# EAGLE design N33_1_0 (EAGLE 8.3.2)
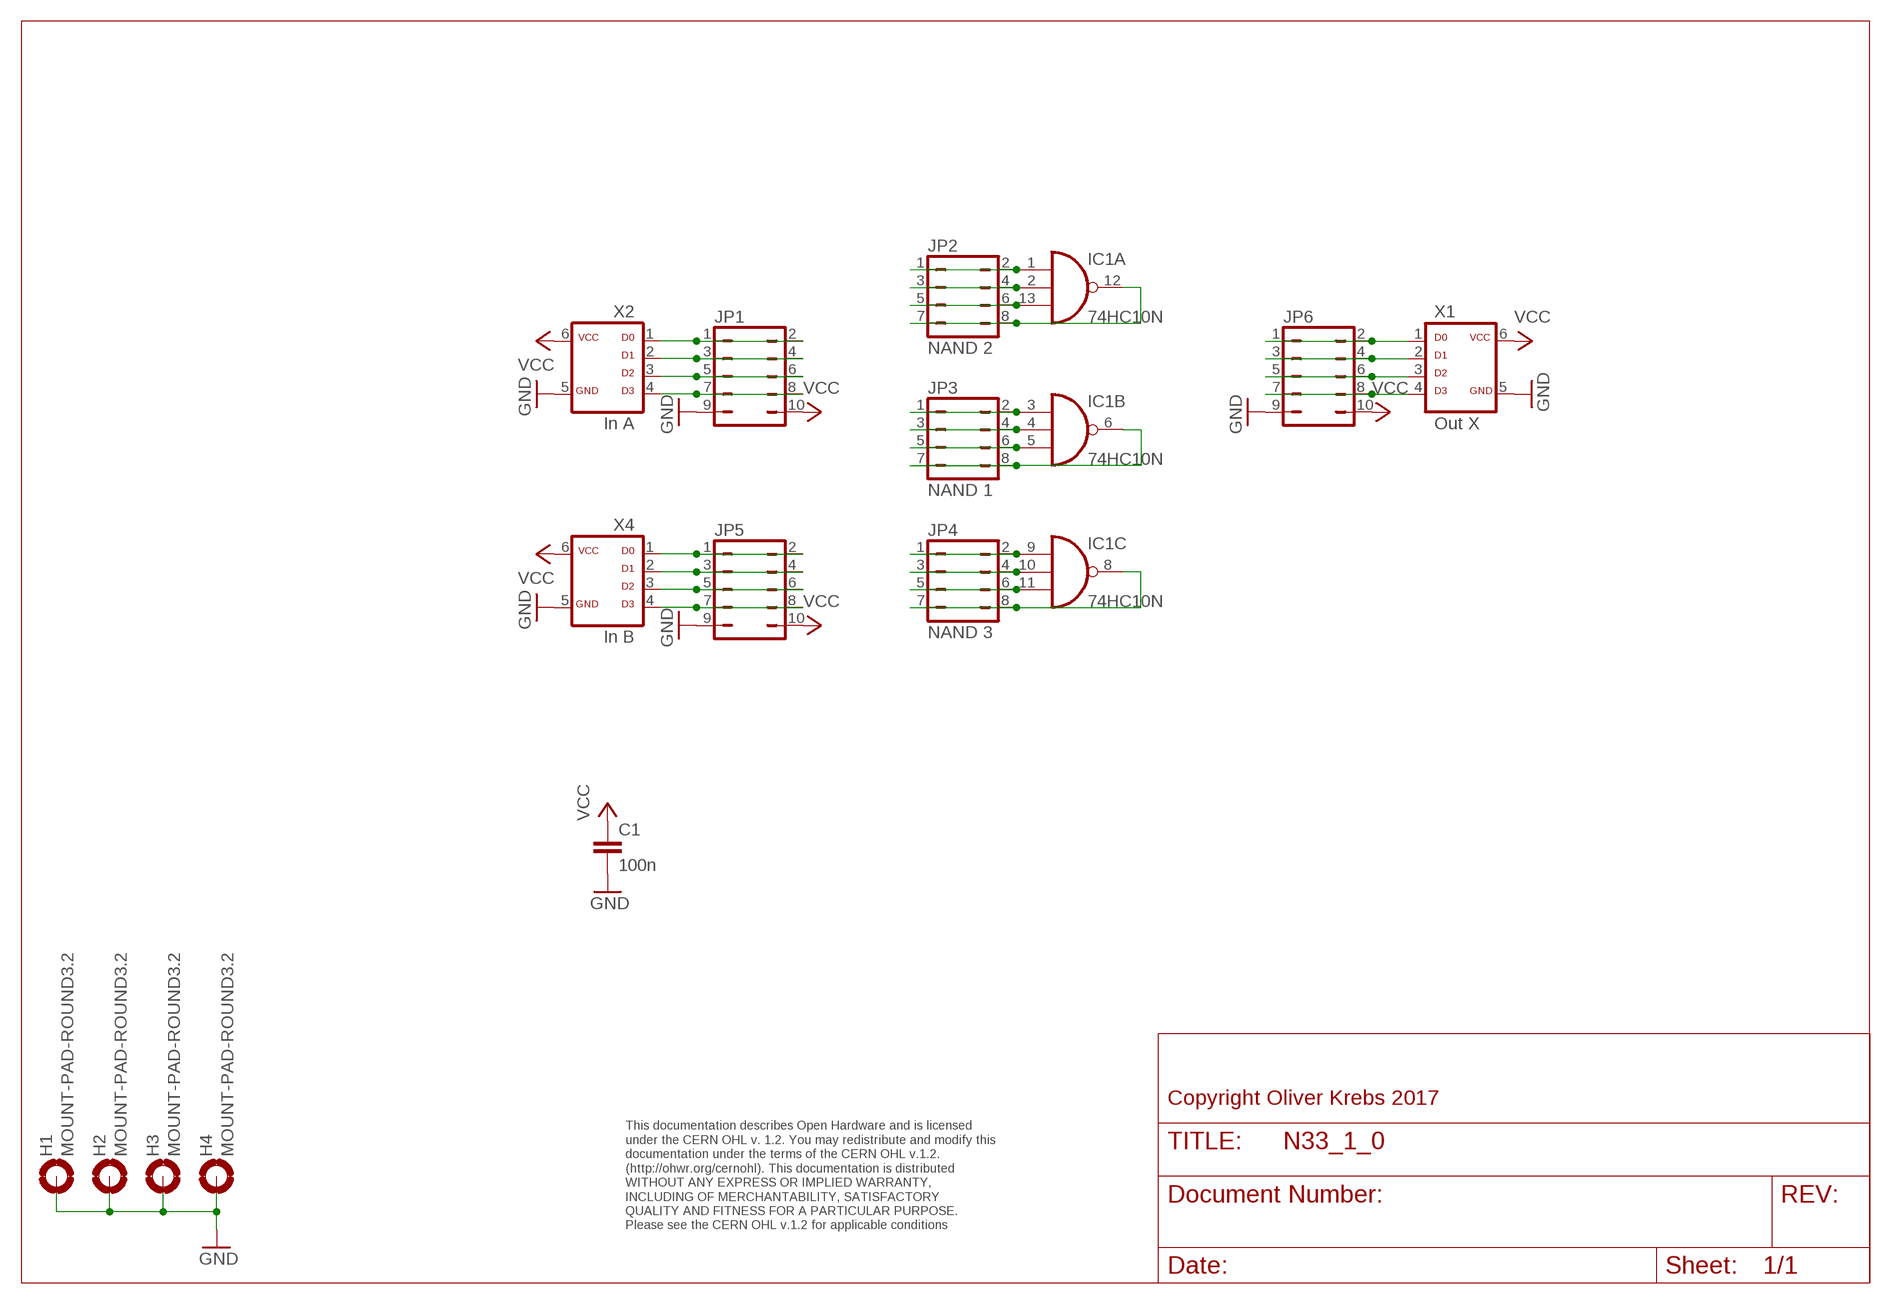
[diagram p0: schematic, sheet 1]

## Parts
C1  100n  C-EU050-025X075  [C050-025X075]
H1  MOUNT-PAD-ROUND3.2  [3,2-PAD]
H2  MOUNT-PAD-ROUND3.2  [3,2-PAD]
H3  MOUNT-PAD-ROUND3.2  [3,2-PAD]
H4  MOUNT-PAD-ROUND3.2  [3,2-PAD]
IC1  74HC10N  [DIL14]
JP1  JP5Q  [JP5Q]
JP2  NAND 2  JP4Q  [JP4Q]
JP3  NAND 1  JP4Q  [JP4Q]
JP4  NAND 3  JP4Q  [JP4Q]
JP5  JP5Q  [JP5Q]
JP6  JP5Q  [JP5Q]
X1  Out X  ML6D  [ML-6]
X2  In A  ML6D  [ML-6]
X4  In B  ML6D  [ML-6]

## Nets
GND: C1.2 H1.B3,2(MOUNT) H2.B3,2(MOUNT) H3.B3,2(MOUNT) H4.B3,2(MOUNT) JP1.9 JP5.9 JP6.9 X1.5 X2.5 X4.5
N$1: IC1.1(A:I0) JP2.1 JP2.2
N$2: IC1.2(A:I1) JP2.3 JP2.4
N$3: IC1.13(A:I2) JP2.5 JP2.6
N$4: IC1.3(B:I0) JP3.1 JP3.2
N$5: IC1.4(B:I1) JP3.3 JP3.4
N$6: JP5.1 JP5.2 X4.1
N$7: JP5.3 JP5.4 X4.2
N$8: JP5.5 JP5.6 X4.3
N$9: JP5.7 JP5.8 X4.4
N$10: IC1.5(B:I2) JP3.5 JP3.6
N$11: IC1.9(C:I0) JP4.1 JP4.2
N$12: IC1.10(C:I1) JP4.3 JP4.4
N$13: IC1.11(C:I2) JP4.5 JP4.6
N$14: JP1.1 JP1.2 X2.1
N$15: JP1.3 JP1.4 X2.2
N$16: JP1.5 JP1.6 X2.3
N$17: JP1.7 JP1.8 X2.4
N$18: JP6.1 JP6.2 X1.1
N$19: JP6.3 JP6.4 X1.2
N$20: JP6.5 JP6.6 X1.3
N$21: JP6.7 JP6.8 X1.4
N$22: IC1.8(C:O) JP4.7 JP4.8
N$23: IC1.6(B:O) JP3.7 JP3.8
N$24: IC1.12(A:O) JP2.7 JP2.8
VCC: C1.1 JP1.10 JP5.10 JP6.10 X1.6 X2.6 X4.6

## Notes on the sheet
- Copyright Oliver Krebs 2017
- This documentation describes Open Hardware and is licensed 
  under the CERN OHL v. 1.2. You may redistribute and modify this 
  documentation under the terms of the CERN OHL v.1.2. 
  (http://ohwr.org/cernohl). This documentation is distributed
  WITHOUT ANY EXPRESS OR IMPLIED WARRANTY, 
  INCLUDING OF MERCHANTABILITY, SATISFACTORY 
  QUALITY AND FITNESS FOR A PARTICULAR PURPOSE. 
  Please see the CERN OHL v.1.2 for applicable conditions

## Power pins joined to a net without a drawn wire
GND: IC1.7(P:GND)
VCC: IC1.14(P:VCC)

## Library data of the parts
C1 = 01-my_rcl:C-EU: CAPACITOR, European symbol
H1-H4 = holes:MOUNT-PAD-ROUND: MOUNTING PAD, round
IC1 = 74xx-eu:74*10: Triple 3-input NAND gate
JP1 JP5 JP6 = 01-my-jumper:JP5Q: JUMPER
JP2-JP4 = 01-my-con:JP4Q
X1 X2 X4 = 01-my-con:ML6D

## Board
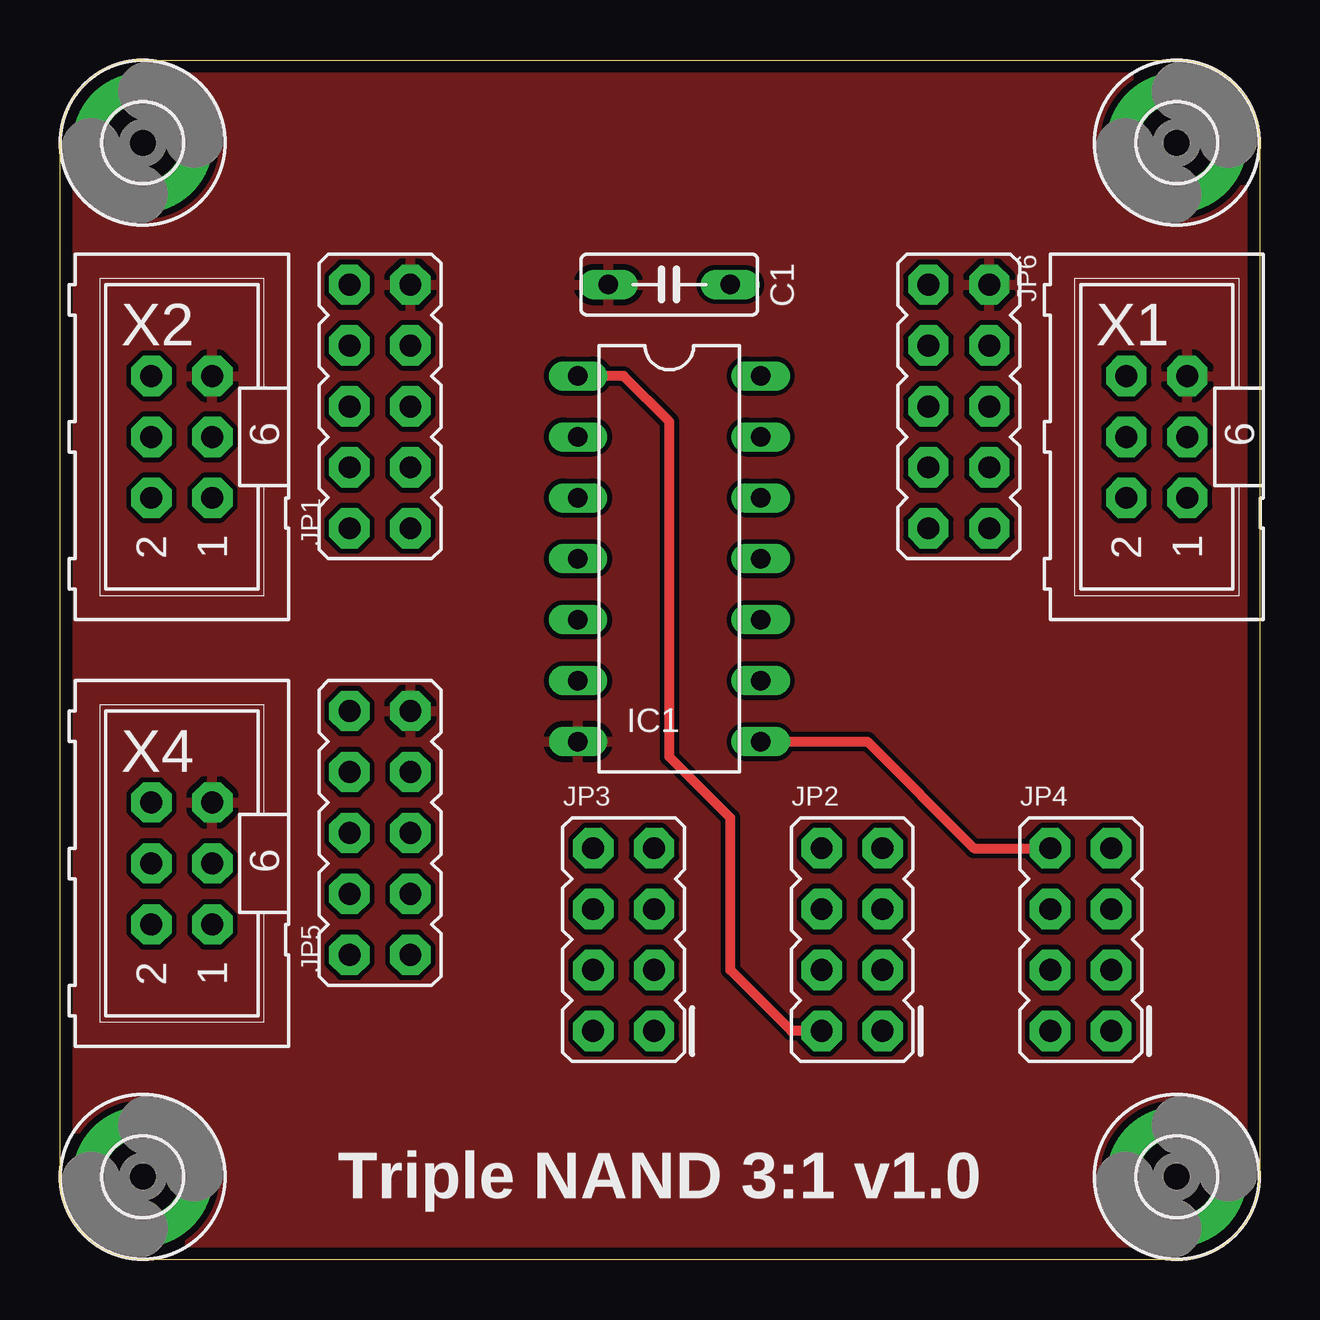
[diagram p1: board, top side]
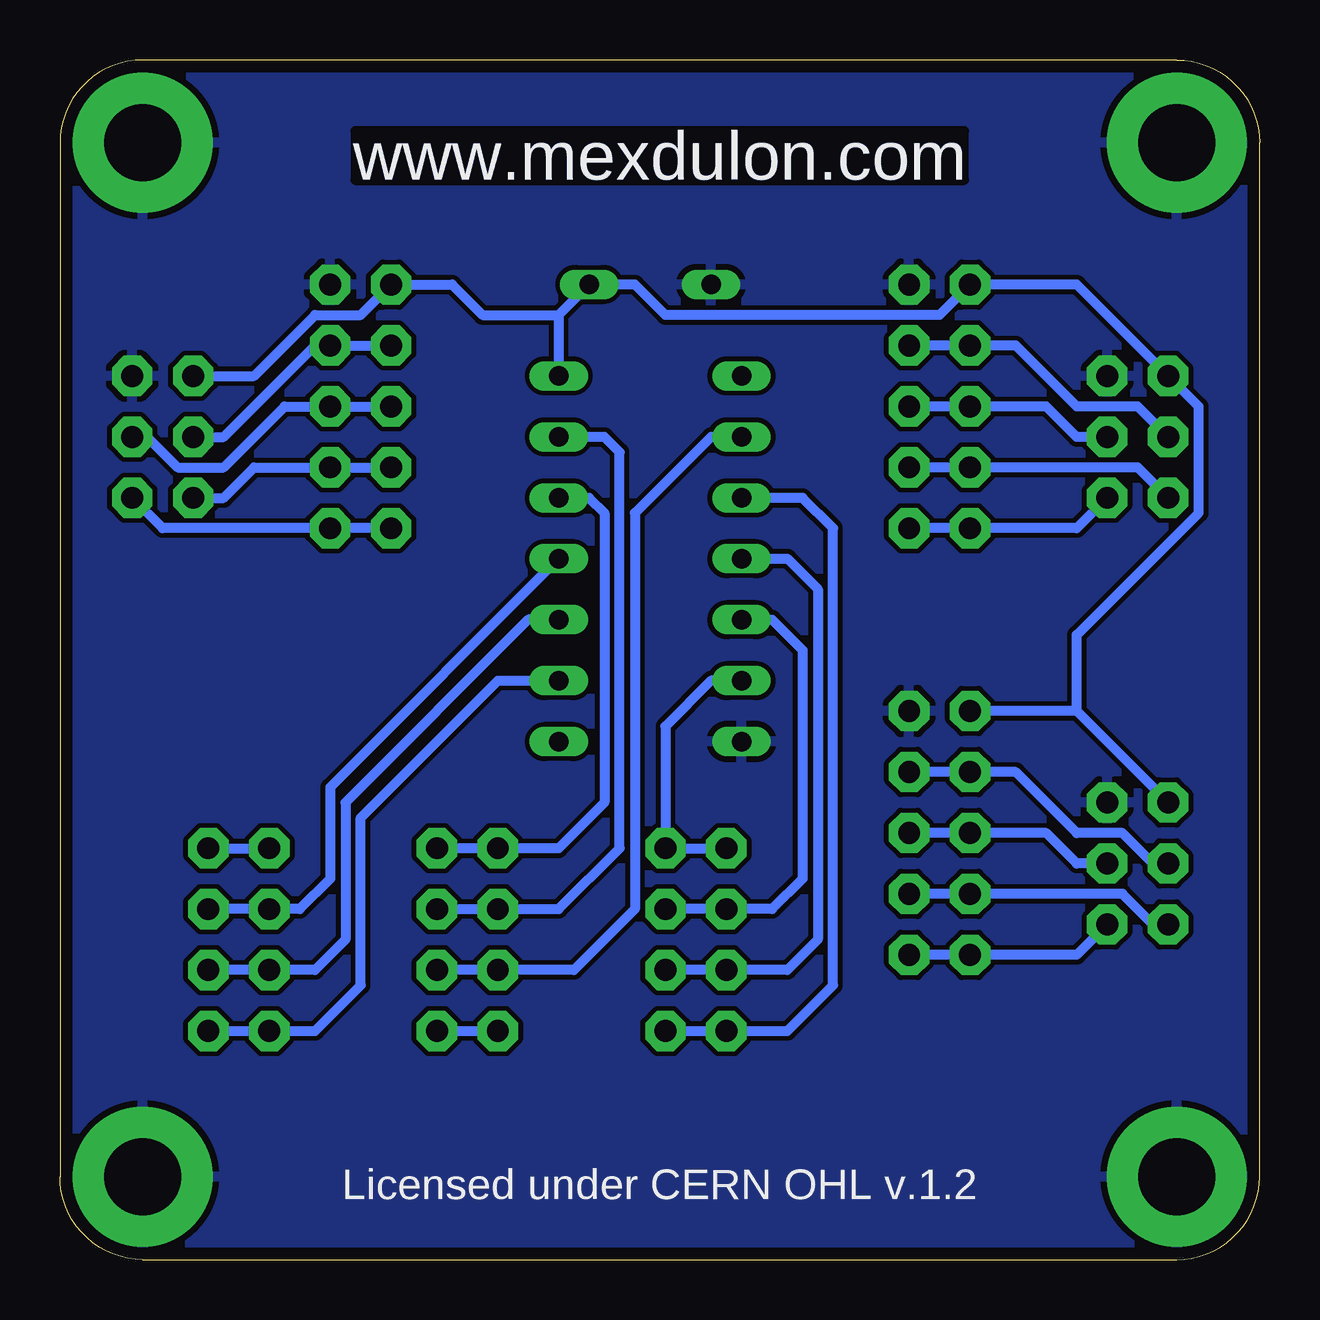
[diagram p2: board, bottom side, seen from below]

Size 50 x 50 mm. Coordinates in mm from the lower left corner, seen from the top.
Outline: 0,3.45 0,46.55 arc-90 3.45,50 46.55,50 arc-90 50,46.55 50,3.45 arc-90 46.55,0 3.45,0 arc-90 0,3.45
Copper layers (1*16): Top 0.035mm / dielectric 1.6mm / Bottom 0.035mm
Design rules "Elecrow_2-layer_PCB_eagle_rule_8mil *": minimum track width 8mil, minimum drill 12mil, track to track 8mil, track to pad 8mil, pad to pad 8mil, via to via 8mil, smd to smd 0mil, copper to edge 20mil, drill to drill 10mil, minimum pad ring 6mil, minimum via ring 6mil, stop-mask expansion 0mil, vias tented up to drill 100mil, thermal gap 10mil

### Footprints (pad centres in the part's own frame; a part is rotated, then mirrored left to right if it is on the bottom)
C050-025X075 = drill 0.813 long: 1 -2.54,0; 2 2.54,0
3,2-PAD = drill 3.2 pad 5.842: B3,2 0,0
DIL14 = drill 0.813 long: 1 -7.62,-3.81; 2 -5.08,-3.81; 3 -2.54,-3.81; 4 0,-3.81; 5 2.54,-3.81; 6 5.08,-3.81; 7 7.62,-3.81; 8 7.62,3.81; 9 5.08,3.81; 10 2.54,3.81; 11 0,3.81; 12 -2.54,3.81; 13 -5.08,3.81; 14 -7.62,3.81
JP5Q = drill 0.914 pad 1.676 octagon: 1 -5.08,-1.27; 2 -5.08,1.27; 3 -2.54,-1.27; 4 -2.54,1.27; 5 0,-1.27; 6 0,1.27; 7 2.54,-1.27; 8 2.54,1.27; 9 5.08,-1.27; 10 5.08,1.27
JP4Q = drill 0.914 pad 1.676 octagon: 1 -3.81,-1.27; 2 -3.81,1.27; 3 -1.27,-1.27; 4 -1.27,1.27; 5 1.27,-1.27; 6 1.27,1.27; 7 3.81,-1.27; 8 3.81,1.27
ML-6 = drill 0.914 pad 1.676 octagon: 1 -2.54,-1.27; 2 -2.54,1.27; 3 0,-1.27; 4 0,1.27; 5 2.54,-1.27; 6 2.54,1.27

### Placement (x,y rotation side)
C1  25.4,40.64 180 top
H1  3.45,3.45 0 top
H2  3.45,46.55 0 top
H3  46.55,46.55 0 top
H4  46.55,3.45 0 top
IC1  25.4,29.21 270 top
JP1  13.34,35.56 90 top
JP2  33.02,13.34 90 top
JP3  23.5,13.34 90 top
JP4  42.55,13.34 90 top
JP5  13.34,17.78 90 top
JP6  37.47,35.56 90 top
X1  45.72,34.29 90 top
X2  5.08,34.29 90 top
X4  5.08,16.51 90 top

### Tracks (layer width: path | path; a pad name or v marks a point on that pad's centre or on a via)
GND
  pour Bottom (isolate 0.203): 0,50.16 50.8,50.16 50.8,0 0,0
  pour Top (isolate 0.203): 0,50.16 50.8,50.16 50.8,0 0,0
N$1
  Top 0.406: JP2.2 30.48,9.53 27.94,12.06 27.94,18.41 25.4,20.95 25.4,34.92 23.5,36.83 IC1.1
  Bottom 0.406: JP2.1 JP2.2
N$2
  Bottom 0.406: JP2.3 JP2.4 28.57,12.06 26.04,14.61 26.04,31.11 22.86,34.29 IC1.2
N$3
  Bottom 0.406: JP2.5 JP2.6 29.21,14.61 26.67,17.14 26.67,33.66 27.3,34.29 IC1.13
N$4
  Bottom 0.406: JP3.1 JP3.2 19.68,9.53 17.78,11.43 17.78,30.48 19.05,31.75 IC1.3
N$5
  Bottom 0.406: JP3.3 JP3.4 19.68,12.06 18.41,13.34 18.41,27.94 19.68,29.21 IC1.4
N$6
  Bottom 0.406: JP5.1 JP5.2 7.62,12.7 X4.1
N$7
  Bottom 0.406: JP5.3 JP5.4 5.71,15.24 4.45,13.97 X4.2
N$8
  Bottom 0.406: JP5.5 JP5.6 8.89,17.78 7.62,16.51 X4.3
N$9
  Bottom 0.406: JP5.7 JP5.8 10.16,20.32 7.62,17.78 5.71,17.78 4.45,16.51 X4.4
N$10
  Bottom 0.406: JP3.5 JP3.6 20.32,14.61 19.05,15.88 19.05,25.4 20.32,26.67 IC1.5
N$11
  Bottom 0.406: JP4.1 JP4.2 39.37,9.53 37.47,11.43 37.47,18.41 31.75,24.13 IC1.9
N$12
  Bottom 0.406: JP4.3 JP4.4 39.37,12.06 38.1,13.34 38.1,19.05 30.48,26.67 IC1.10
N$13
  Bottom 0.406: JP4.5 JP4.6 40.01,14.61 38.73,15.88 38.73,19.68 IC1.11
N$14
  Bottom 0.406: JP1.1 JP1.2 7.62,30.48 X2.1
N$15
  Bottom 0.406: JP1.3 JP1.4 5.08,33.02 X2.2
N$16
  Bottom 0.406: JP1.5 JP1.6 8.89,35.56 7.62,34.29 X2.3
N$17
  Bottom 0.406: JP1.7 JP1.8 10.16,38.1 7.62,35.56 5.08,35.56 X2.4
N$18
  Bottom 0.406: JP6.2 JP6.1 45.72,30.48 X1.1
N$19
  Bottom 0.406: JP6.4 JP6.3 41.91,33.02 43.18,31.75 X1.2
N$20
  Bottom 0.406: JP6.6 JP6.5 40.64,35.56 43.18,33.02 45.09,33.02 46.35,34.29 X1.3
N$21
  Bottom 0.406: JP6.8 JP6.7 39.37,38.1 43.18,34.29 X1.4
N$22
  Top 0.406: IC1.8 33.66,21.59 38.1,17.14 JP4.8
  Bottom 0.406: JP4.7 JP4.8
N$23
  Bottom 0.406: JP3.8 JP3.7 24.77,22.23 22.86,24.13 IC1.6
N$24
  Bottom 0.406: JP2.7 JP2.8 29.21,17.14 27.3,19.05 27.3,31.11 27.94,31.75 IC1.12
VCC
  Bottom 0.406: 29.21,39.37 C1.1 26.04,40.64 24.77,39.37 13.34,39.37 JP1.10 7.62,40.64 X2.6 2.54,35.56 2.54,31.11 7.62,26.04 7.62,22.86 | 29.21,39.37 IC1.14 | 29.21,39.37 32.38,39.37 33.66,40.64 JP6.10 37.47,39.37 39.37,39.37 41.91,36.83 X1.6 | X4.6 7.62,22.86 | 7.62,22.86 JP5.10

### Text on the board
Bottom: www.mexdulon.com
tNames: Triple NAND 3:1 v1.0
bNames: www.mexdulon.com | Licensed under CERN OHL v.1.2
tValues: + | - | + | - | 4 | 4 | 3 | 3 | 2 | 2 | 1 | 1 | + | - | 4 | 3 | Out | Out | Out | 2 | 3 | 3 | 3 | 1 | 2 | 2 | 2 | 1 | 1 | 1
200bmp: E:/Bilder/Elektronik/Modulion/Mexdulon/mexdulon_50x50_pcb.bmp